# Altium project Digital Watch.PrjPcb
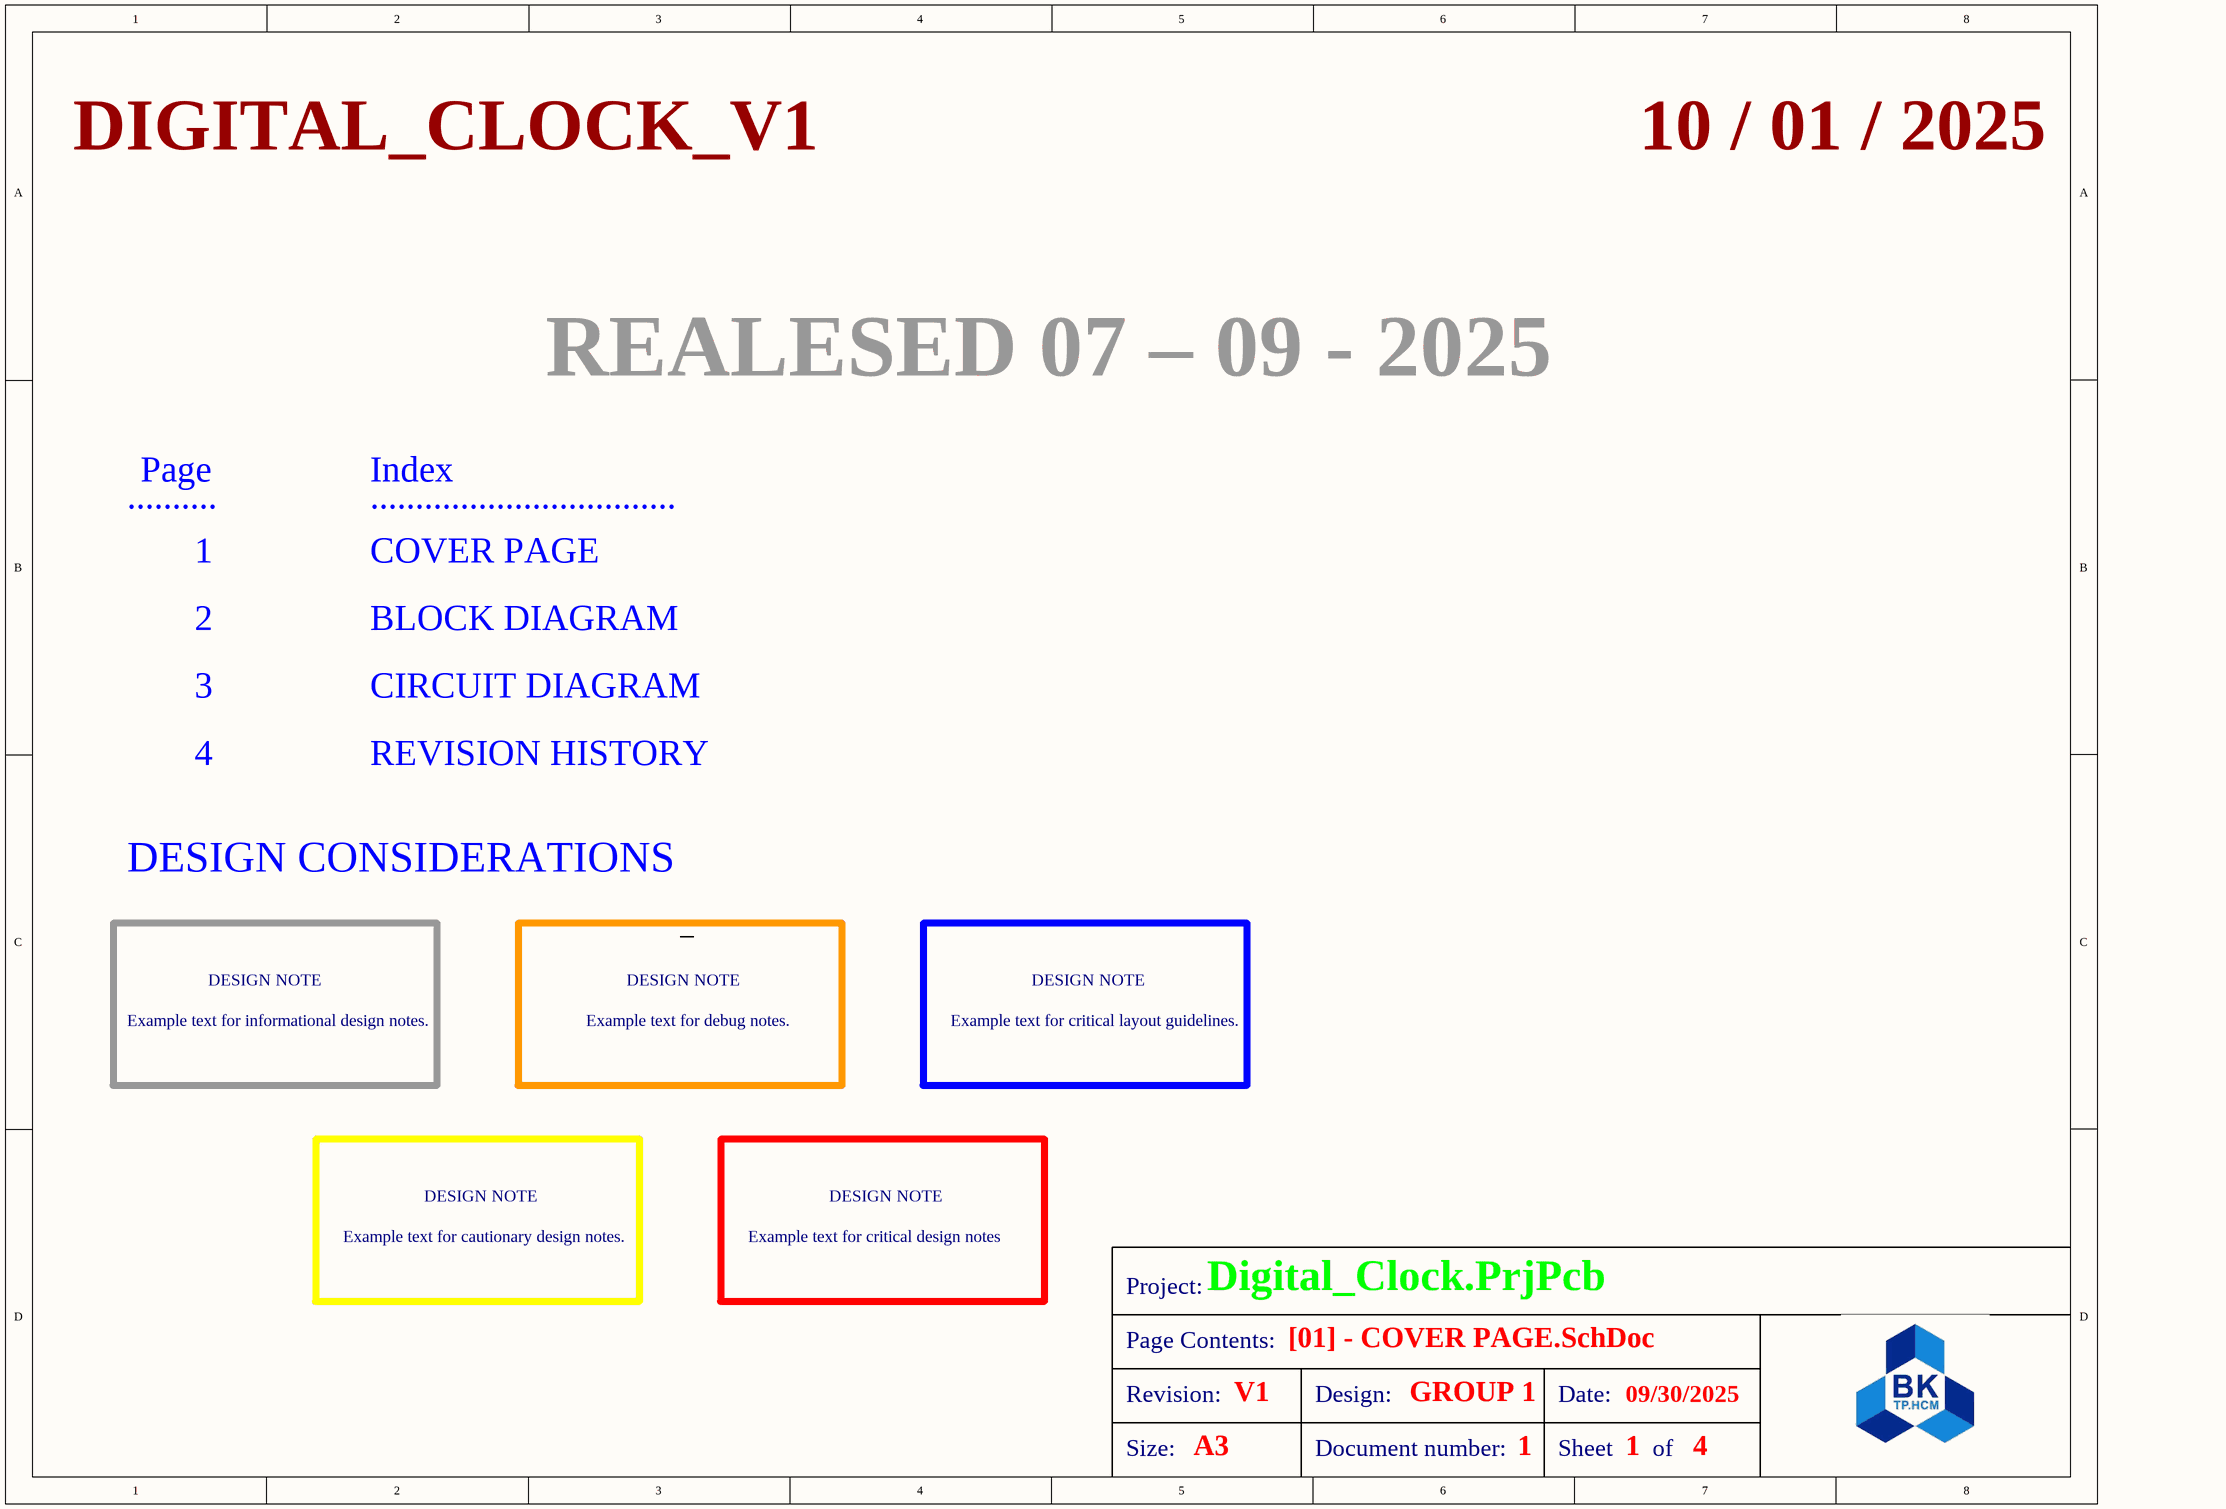
[diagram p0: BIA1.SchDoc]
5 sheets, 37 parts. Net scope: global (net labels, ports and power ports of the same name join across sheets).
Board file: PCB1.PcbDoc
Sheets:
  BIA1.SchDoc
  BLOCK DIAGRAM.SchDoc
  MCU.SchDoc
  LCD_BT.SchDoc
  Power_BZ_LED_HD.SchDoc

## Sheet BIA1.SchDoc
size A3

### Notes on the sheet
- DIGITAL_CLOCK_V1
- 10 / 01 / 2025
- REALESED 07 – 09 - 2025
- ..........
- Page
- Index
- ..................................
- 1
- COVER PAGE
- 2
- BLOCK DIAGRAM
- 3
- CIRCUIT DIAGRAM
- 4
- REVISION HISTORY
- DESIGN CONSIDERATIONS
- DESIGN NOTE
- Example text for informational design notes.
- Example text for debug notes.
- Example text for critical layout guidelines.
- Example text for cautionary design notes.
- Example text for critical design notes
- [01] - COVER PAGE.SchDoc
- A3
- V1
- GROUP 1
- 09/30/2025
- Project:
- Digital_Clock.PrjPcb
- Page Contents:
- Revision:
- Size:
- Design:
- Document number:
- Date:
- Sheet
- of

## Sheet BLOCK DIAGRAM.SchDoc
size A3; SheetNumber: 1; SheetTotal: 1
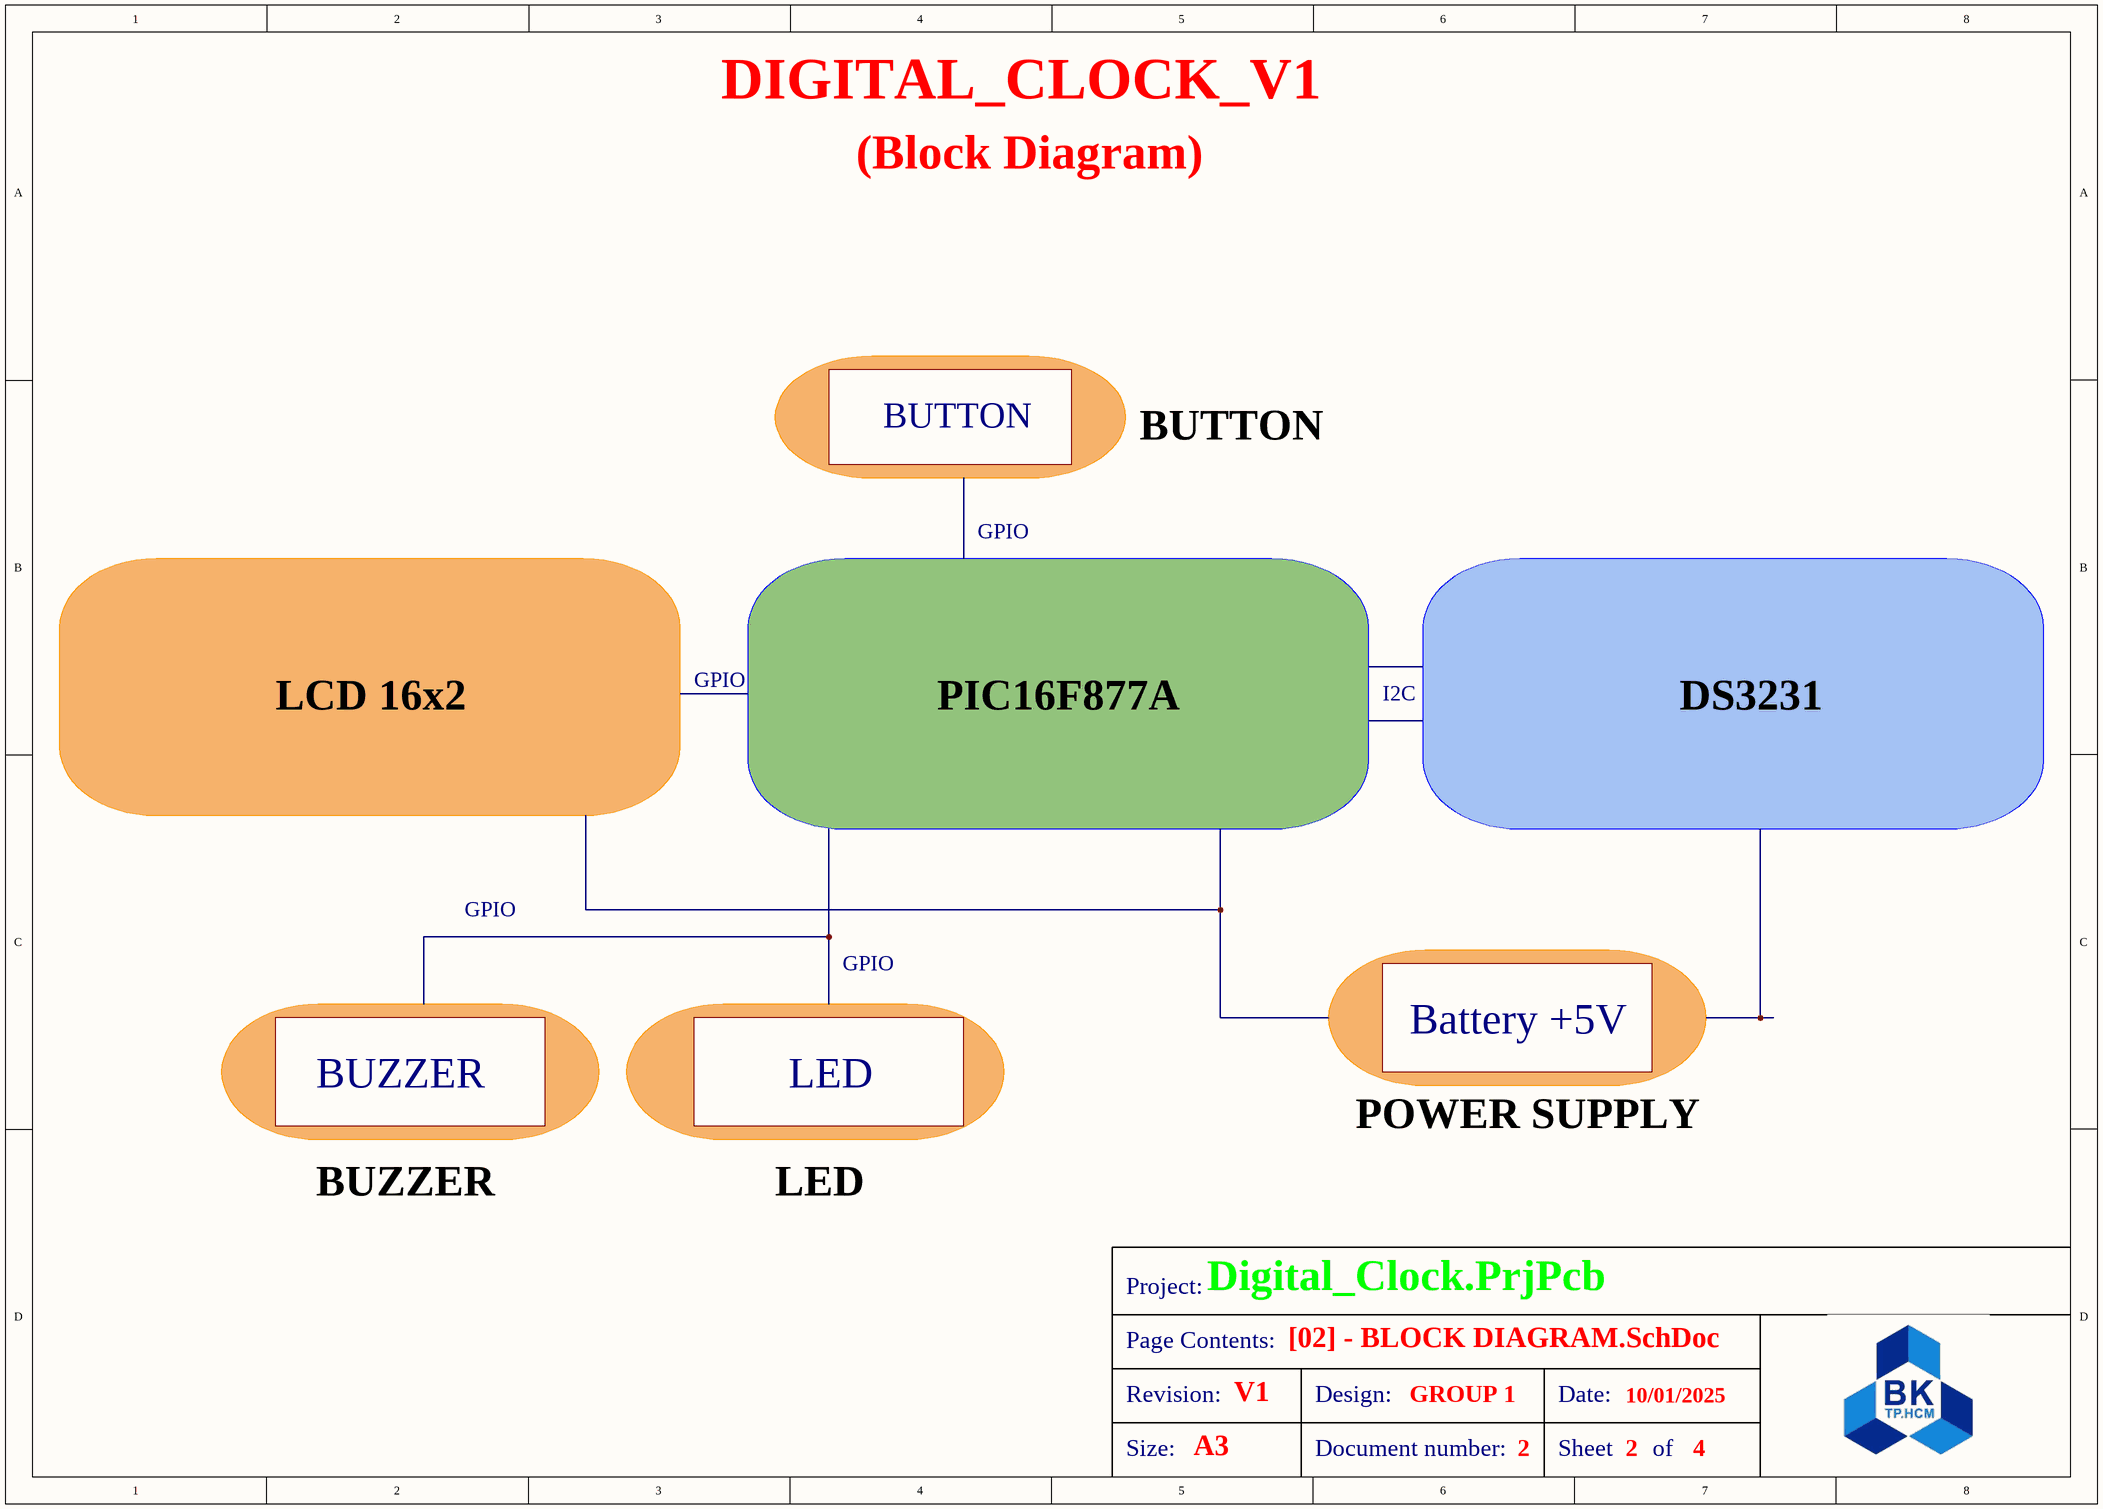
[diagram p1: BLOCK DIAGRAM.SchDoc]

### Notes on the sheet
- DIGITAL_CLOCK_V1
- (Block Diagram)
- BUTTON
- GPIO
- LCD 16x2
- PIC16F877A
- I2C
- DS3231
- Battery +5V
- BUZZER
- LED
- POWER SUPPLY
- [02] - BLOCK DIAGRAM.SchDoc
- A3
- V1
- GROUP 1
- 2
- 10/01/2025
- 4
- Project:
- Digital_Clock.PrjPcb
- Page Contents:
- Revision:
- Size:
- Design:
- Document number:
- Date:
- Sheet
- of

## Sheet MCU.SchDoc
size A3; SheetNumber: 3; SheetTotal: 6
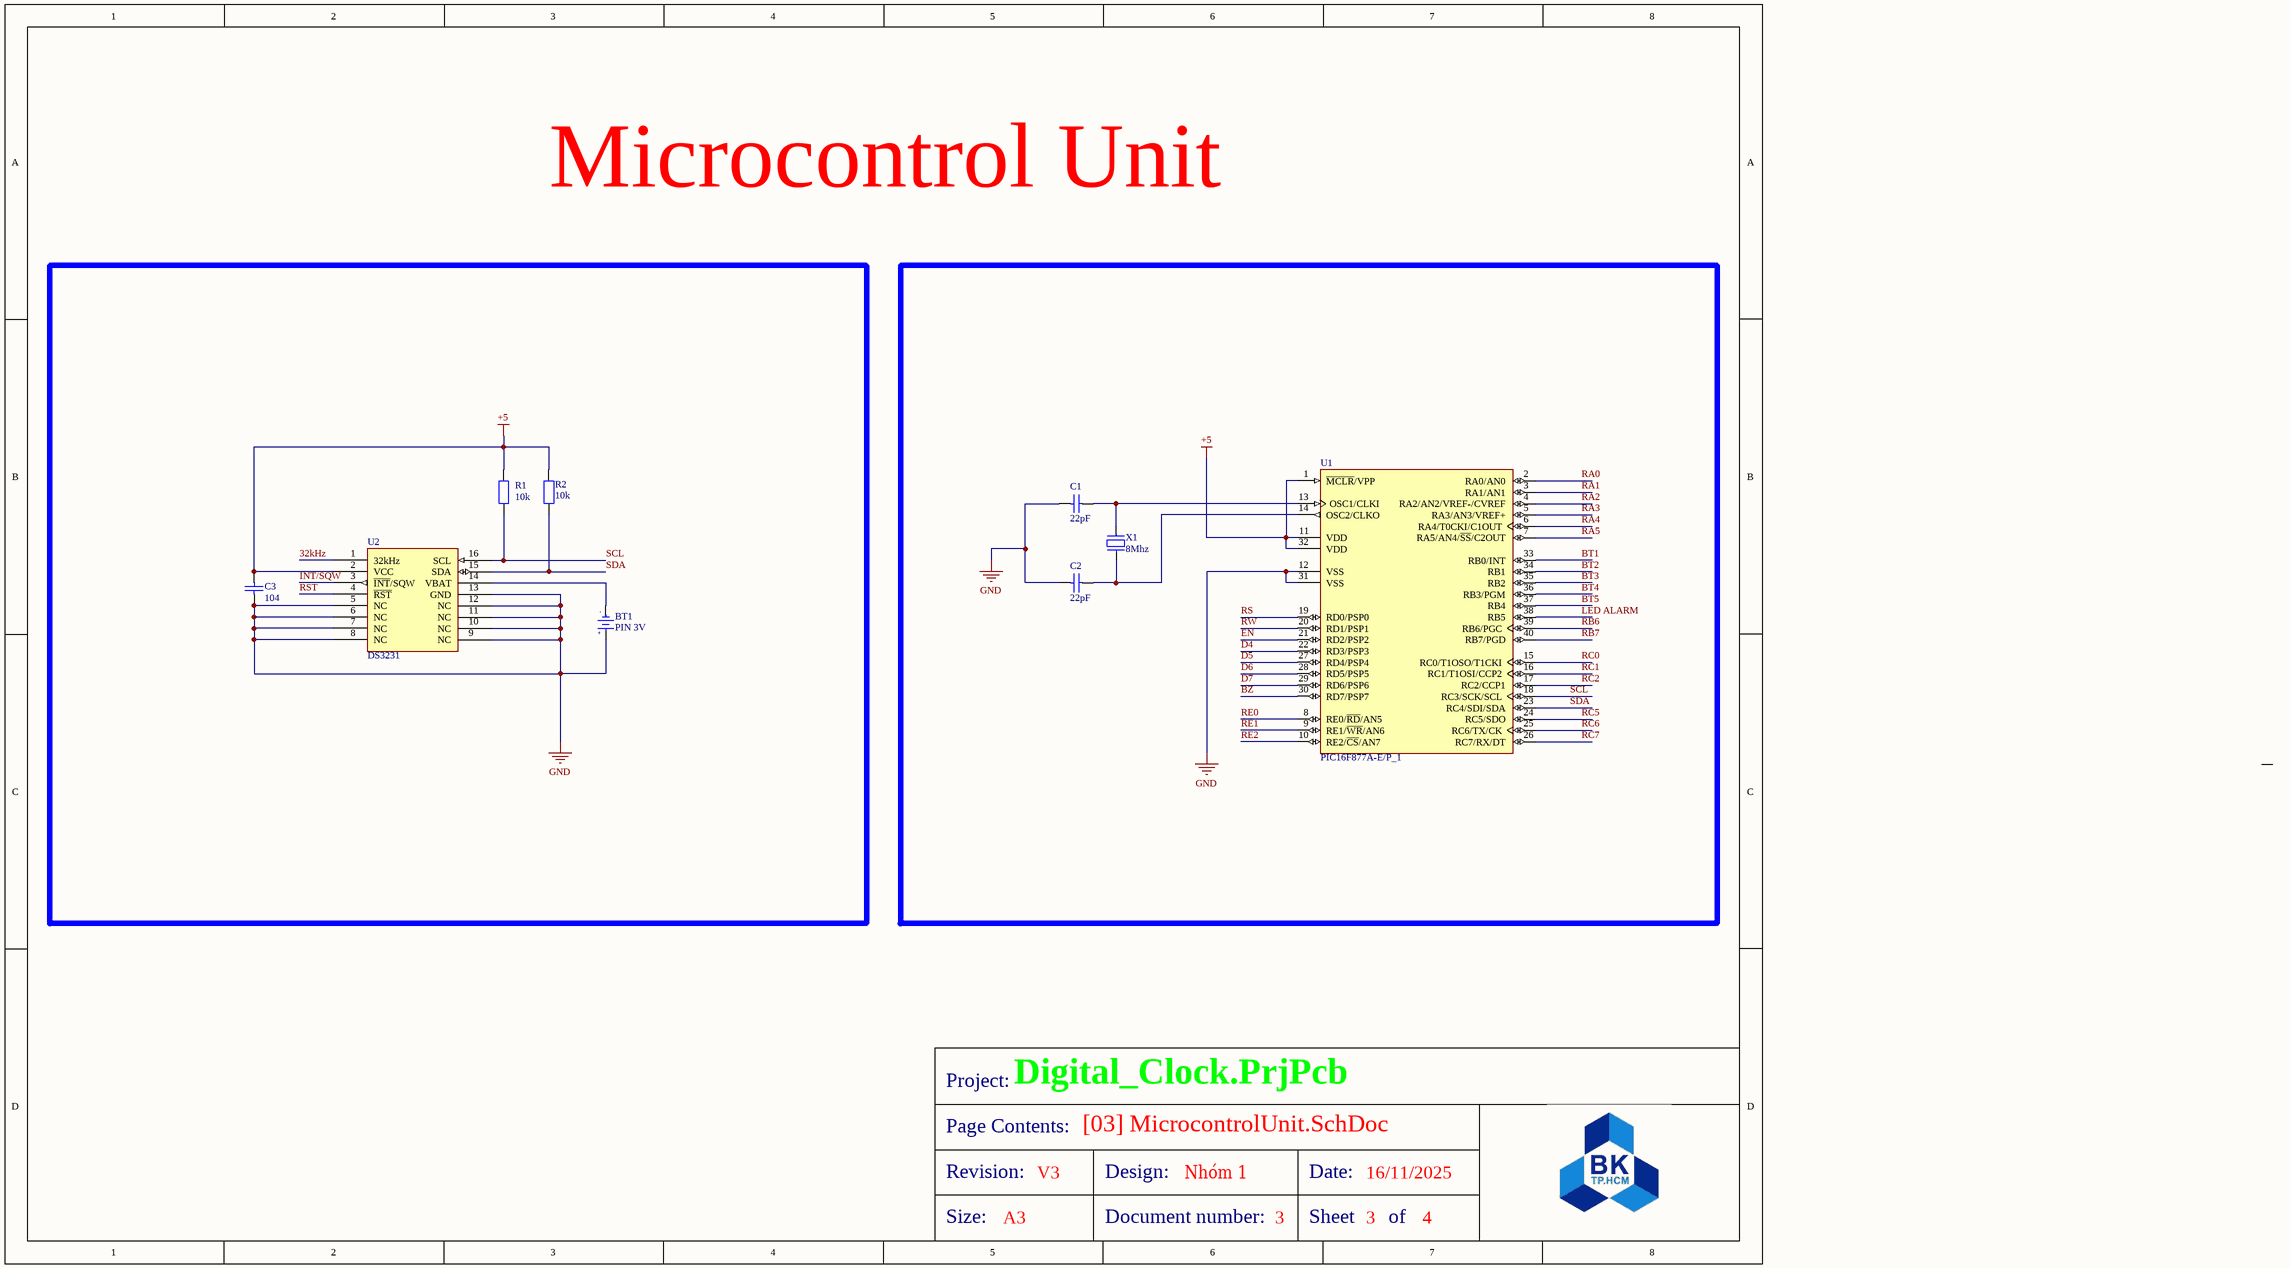
[diagram p2: MCU.SchDoc]

### Parts
BT1  PIN 3V  [PIN3V]
C1  22pF  [tu gom]
C2  22pF  [tu gom]
C3  104  [tu gom]
R1  10k  [tro smd 0603]
R2  10k  [tro smd 0603]
U1  PIC16F877A-E/P_1  [PDIP600-P40]
U2  DS3231  [SL3016]
X1  8Mhz  [XT2]

### Nets
+5: C3.1 R1.2 R2.2 U1.1(~{MCLR}/VPP) U1.11(VDD) U1.32(VDD) U2.2(VCC)
GND: BT1.1(+3V) C1.2 C2.2 C3.2 U1.12(VSS) U1.31(VSS) U2.5(NC) U2.6(NC) U2.7(NC) U2.8(NC) U2.9(NC) U2.10(NC) U2.11(NC) U2.12(NC) U2.13(GND)
32kHz: U2.1(32kHz)
BT1: U1.33(RB0/INT)
BT2: U1.34(RB1)
BT3: U1.35(RB2)
BT4: U1.36(RB3/PGM)
BT5: U1.37(RB4)
BZ: U1.30(RD7/PSP7)
D4: U1.22(RD3/PSP3)
D5: U1.27(RD4/PSP4)
D6: U1.28(RD5/PSP5)
D7: U1.29(RD6/PSP6)
EN: U1.21(RD2/PSP2)
INT/SQW: U2.3(~{INT}/SQW)
LED ALARM: U1.38(RB5)
RA0: U1.2(RA0/AN0)
RA1: U1.3(RA1/AN1)
RA2: U1.4(RA2/AN2/VREF-/CVREF)
RA3: U1.5(RA3/AN3/VREF+)
RA4: U1.6(RA4/T0CKI/C1OUT)
RA5: U1.7(RA5/AN4/~{SS}/C2OUT)
RB6: U1.39(RB6/PGC)
RB7: U1.40(RB7/PGD)
RC0: U1.15(RC0/T1OSO/T1CKI)
RC1: U1.16(RC1/T1OSI/CCP2)
RC2: U1.17(RC2/CCP1)
RC5: U1.24(RC5/SDO)
RC6: U1.25(RC6/TX/CK)
RC7: U1.26(RC7/RX/DT)
RE0: U1.8(RE0/~{RD}/AN5)
RE1: U1.9(RE1/~{WR}/AN6)
RE2: U1.10(RE2/~{CS}/AN7)
RS: U1.19(RD0/PSP0)
RST: U2.4(~{RST})
RW: U1.20(RD1/PSP1)
SCL: R1.1 U1.18(RC3/SCK/SCL) U2.16(SCL)
SDA: R2.1 U1.23(RC4/SDI/SDA) U2.15(SDA)
NetBT1_2: BT1.2(GND) U2.14(VBAT)
NetC1_1: C1.1 U1.13(OSC1/CLKI) X1.1
NetC2_1: C2.1 U1.14(OSC2/CLKO) X1.2

### Notes on the sheet
- Microcontrol Unit
- Project:
- Digital_Clock.PrjPcb
- Page Contents:
- [03] MicrocontrolUnit.SchDoc
- Revision:
- Size:
- A3
- V3
- Design:
- Document number:
- Nhóm 1
- 3
- Date:
- Sheet
- 16/11/2025
- of
- 4
- (in symbol PIN 3V) -; +

### Library data of the parts
BT1 = PIN 3V: Battery 3VDC; Value: PIN 3V
C1 C2 = Tu gom 22pF 50V: Cắm; Don_Vi: Con; So_Chan: 2; Ten_Linh_Kien: Tụ gốm 22P 50V; Ma_Hang: MH004771; Chung_Loai: Cắm; Kieu_Chan: *
C3 = Tu gom 104 50V: Cắm; So_Chan: 2; Ten_Linh_Kien: Tụ gốm 104 100nF 50V; Don_Vi: Con; Ma_Hang: MH004761; Chung_Loai: Cắm; Kieu_Chan: *
R1 R2 = Tro Vach 1/4W 5% 10k: Căm; Chung_Loai: Cắm; Don_Vi: Con; So_Chan: 2; Ten_Linh_Kien: Trở Vạch 1/4w 5% 10K; Ma_Hang: MH007354; Kieu_Chan: *
U1 = PIC16F877A-E/P_1: Enhanced FLASH Microcontroller, 8K (x14-Bit words) FLASH, 368 Bytes RAM, 40-Pin PDIP, Standard VDD Range, Extended Temperature; ComponentAvailability: Unknown. Contact manufacturer to determine status.; Published: 11-Oct-2004; LatestRevisionDate: 29-Jan-2009; LatestRevisionNote: Sch. layout revised. 3D Model Removed.; DatasheetVersion: revB, Oct-2003; PackageVersion: revBB, Aug-2009; PackageReference: PDIP600-P40; Publisher: Altium Limited; PackageDescription: 40-Lead Plastic Dual In-Line (P) - 600 mil Body [PDIP]; Supplier 1: Digi-Key; Supplier Part Number 1: PIC16F877A-E/P-ND; Supplier 2: Farnell; Supplier Part Number 2: 1567990; ComponentLink1Description: Datasheet; ComponentLink1URL: http://ww1.microchip.com/downloads/en/DeviceDoc/39582b.pdf; ComponentLink2Description: Packaging Specification; ComponentLink2URL: http://www.microchip.com/stellent/groups/techpub_sg/documents/packagingspec/en012702.pdf; ComponentLink3Description: Microchip.com Home; ComponentLink3URL: http://www.microchip.com/
X1 = XT2: Crystal For all Crystal 2pin.; Value: 8Mhz

## Sheet LCD_BT.SchDoc
size A3; SheetNumber: 4; SheetTotal: 6
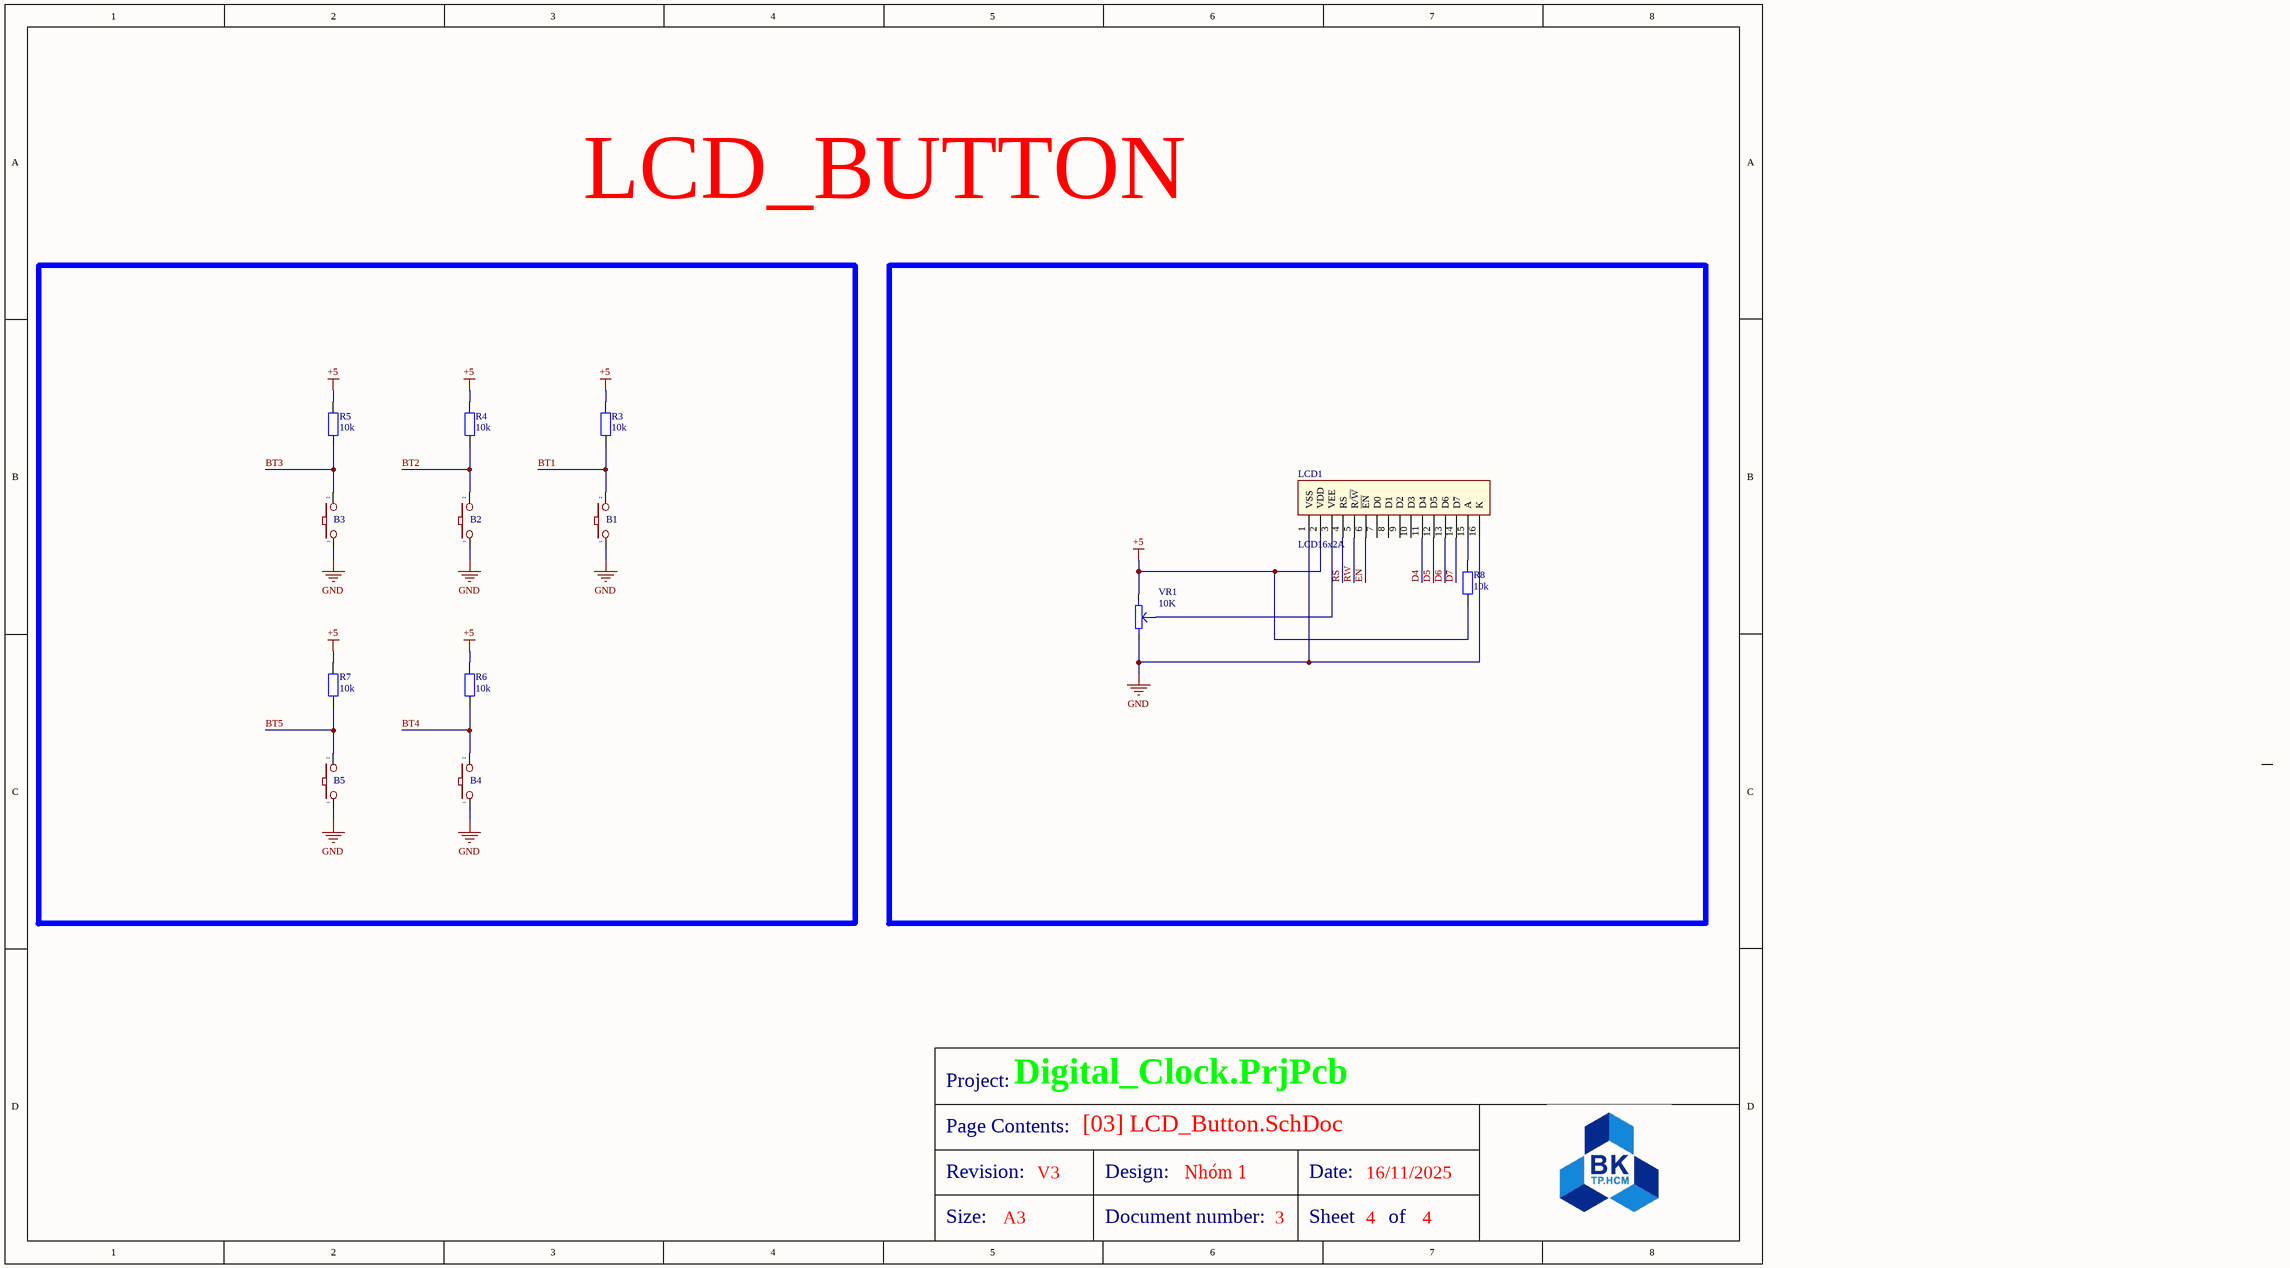
[diagram p3: LCD_BT.SchDoc]

### Parts
B1  (no value)  [SW2]
B2  (no value)  [SW2]
B3  (no value)  [SW2]
B4  (no value)  [SW2]
B5  (no value)  [SW2]
LCD1  LCD16x2A  [LCD16X2]
R3  10k  [tro smd 0603]
R4  10k  [tro smd 0603]
R5  10k  [tro smd 0603]
R6  10k  [tro smd 0603]
R7  10k  [tro smd 0603]
R8  10k  [tro smd 0603]
VR1  10K  [Bien Tro Tam Giac Dung]

### Nets
+5: LCD1.2(VDD) R3.1 R4.1 R5.1 R6.1 R7.1 R8.1 VR1.1
GND: B1.1 B2.1 B3.1 B4.1 B5.1 LCD1.1(VSS) LCD1.16(K) VR1.3
BT1: B1.2 R3.2
BT2: B2.2 R4.2
BT3: B3.2 R5.2
BT4: B4.2 R6.2
BT5: B5.2 R7.2
D4: LCD1.11(D4)
D5: LCD1.12(D5)
D6: LCD1.13(D6)
D7: LCD1.14(D7)
EN: LCD1.6(~{EN})
RS: LCD1.4(RS)
RW: LCD1.5(R/~{W})
NetLCD1_3: LCD1.3(VEE) VR1.2
NetLCD1_15: LCD1.15(A) R8.2

Not connected (* = marked no-connect by the designer): LCD1 7(D0) 8(D1) 9(D2) 10(D3)

### Notes on the sheet
- LCD_BUTTON
- Project:
- Digital_Clock.PrjPcb
- Page Contents:
- [03] LCD_Button.SchDoc
- Revision:
- Size:
- A3
- V3
- Design:
- Document number:
- Nhóm 1
- 3
- Date:
- Sheet
- 16/11/2025
- 4
- of

### Library data of the parts
B1-B5 = SW2: Switch button 2 pin; Value: SW chip 2 pin
LCD1 = LCD16x2: LCD dipslay 16 char, 2 line; Value: LCD16x2A
R3-R8 = Tro Vach 1/4W 5% 10k: as R1 on sheet MCU; Kieu_Chan: *
VR1 = Bien tro tam giac 10K Dung: Cắm; Ma_Hang: MH000919; Don_Vi: Con; Ten_Linh_Kien: Biến Trở Tam Giác 103-10K RM065 (Chân Đứng); Chung_Loai: Cắm; Kieu_Chan: *

## Sheet Power_BZ_LED_HD.SchDoc
size A3; SheetNumber: 5; SheetTotal: 6
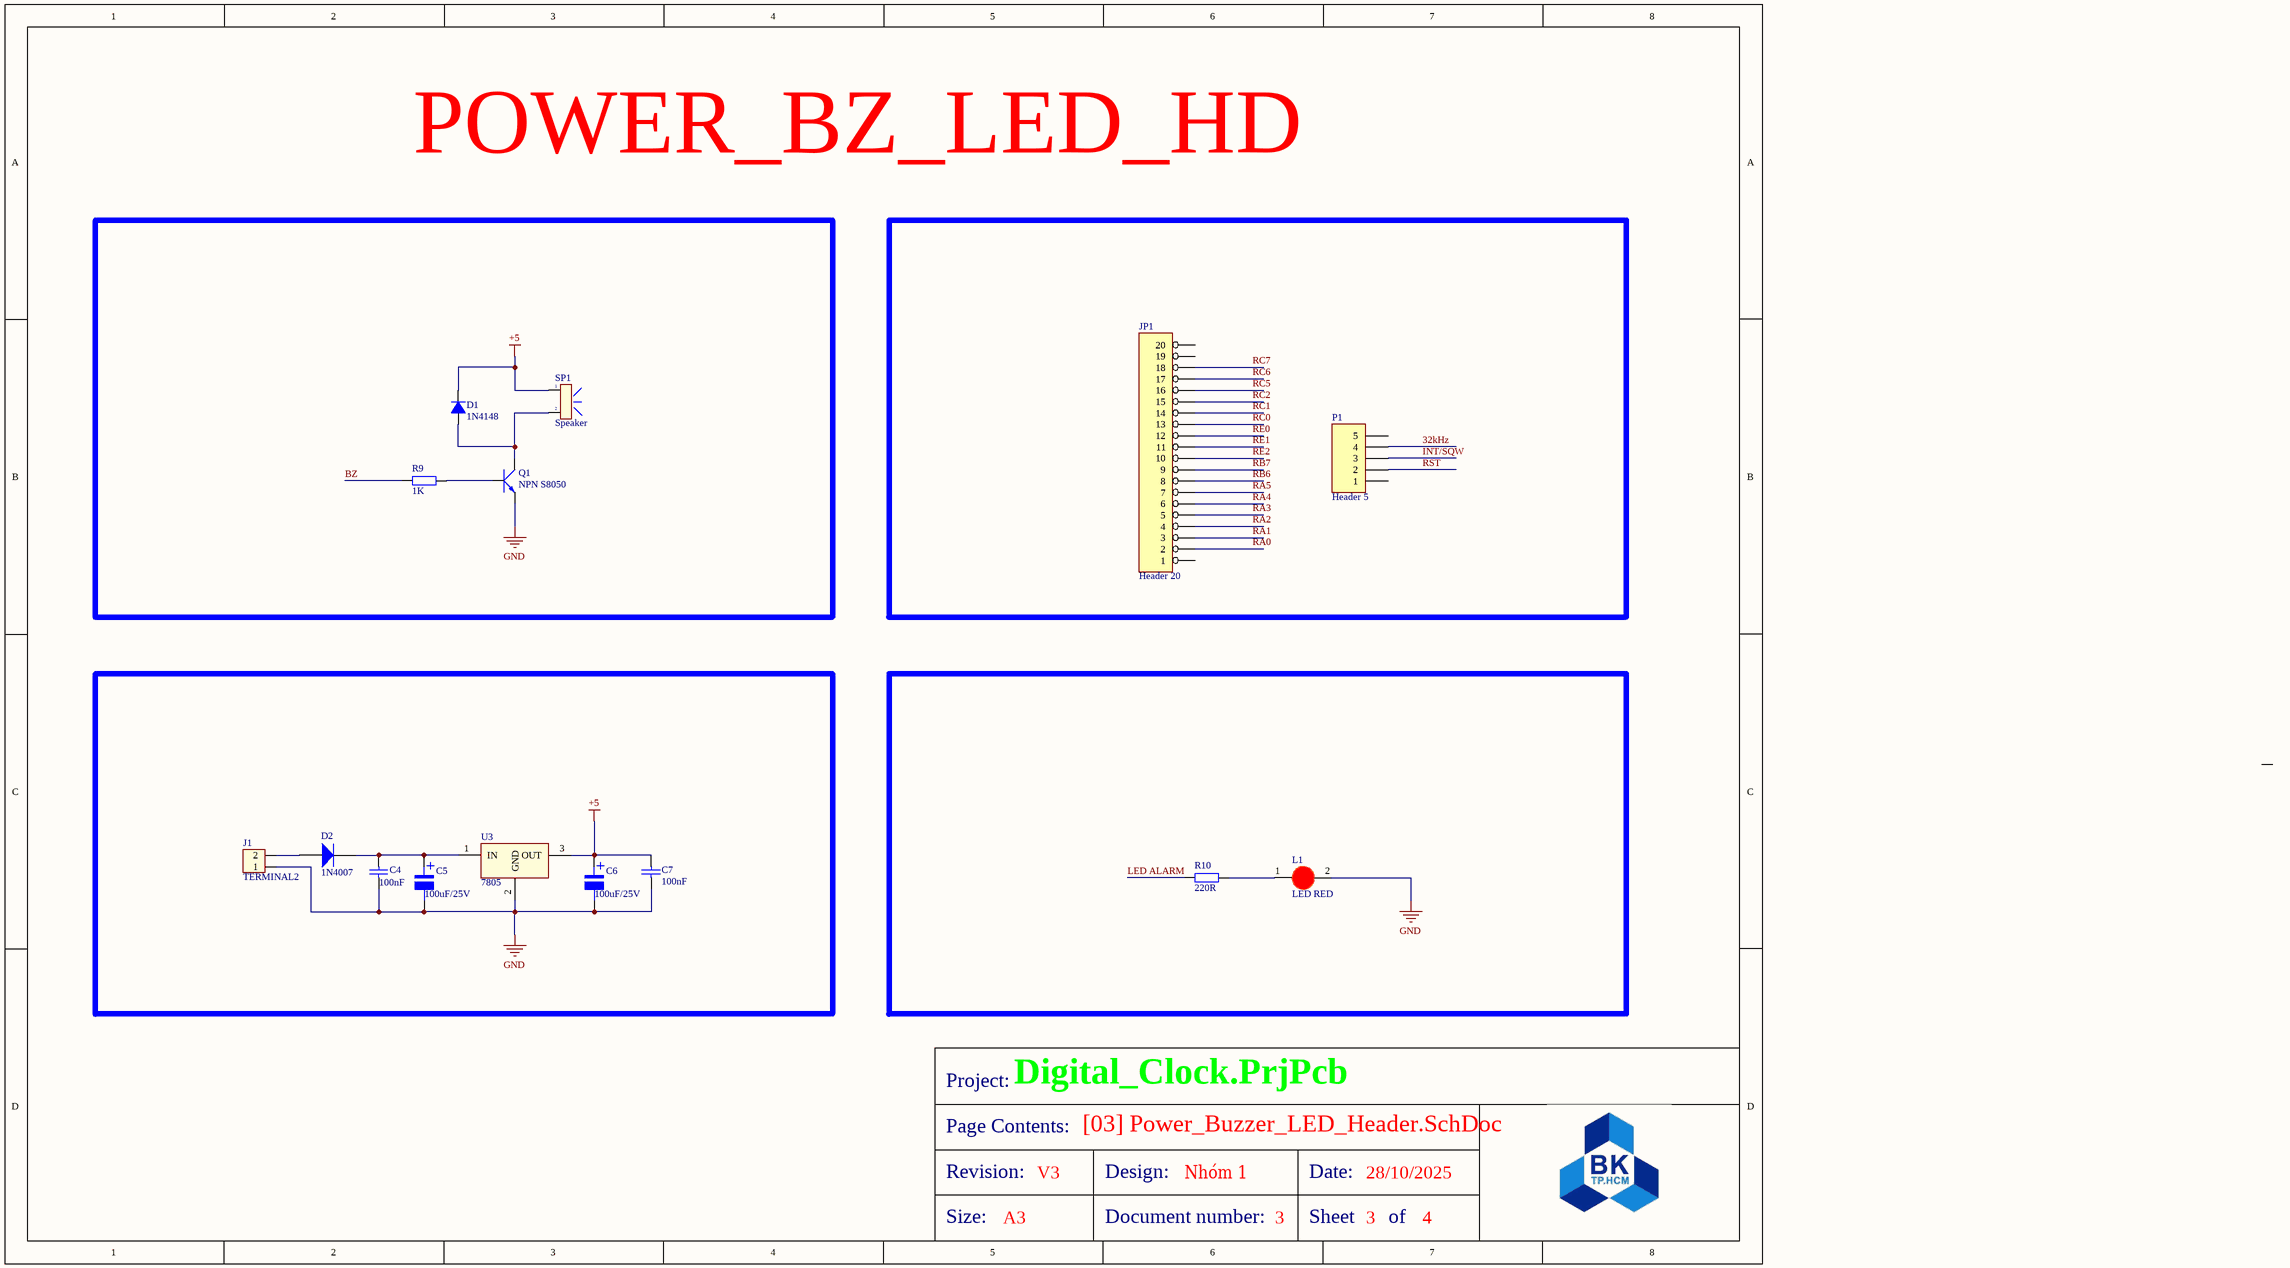
[diagram p4: Power_BZ_LED_HD.SchDoc]

### Parts
C4  100nF  [tu gom]
C5  100uF/25V  [tu nhom 10 (g)]
C6  100uF/25V  [tu nhom 10 (g)]
C7  100nF  [tu gom]
D1  1N4148  [DIODE 0.5A]
D2  1N4007  [DIODE SOD-123]
J1  TERMINAL2  [Header 2P DC 2.54]
JP1  Header 20
L1  LED RED  [LED-5MM-RED]
P1  Header 5
Q1  NPN S8050  [QTO-92]
R9  1K  [tro smd 0603]
R10  220R  [tro vach 1/4w]
SP1  Speaker  [SPK]
U3  7805  [QTO-220]

### Nets
+5: C6.1 C7.1 D1.2(K) SP1.1 U3.3(OUT)
GND: C4.2 C5.2 C6.2 C7.2 J1.1 L1.2(K) Q1.1(E) U3.2(GND)
32kHz: P1.4
BZ: R9.1
INT/SQW: P1.3
LED ALARM: R10.1
RA0: JP1.2
RA1: JP1.3
RA2: JP1.4
RA3: JP1.5
RA4: JP1.6
RA5: JP1.7
RB6: JP1.8
RB7: JP1.9
RC0: JP1.13
RC1: JP1.14
RC2: JP1.15
RC5: JP1.16
RC6: JP1.17
RC7: JP1.18
RE0: JP1.12
RE1: JP1.11
RE2: JP1.10
RST: P1.2
NetC4_1: C4.1 C5.1 D2.2(K) U3.1(IN)
NetD1_1: D1.1(A) Q1.2(C) SP1.2
NetD2_1: D2.1(A) J1.2
NetL1_1: L1.1(A) R10.2
NetQ1_3: Q1.3(B) R9.2

Not connected (* = marked no-connect by the designer): JP1 1 19 20; P1 1 5

### Notes on the sheet
- POWER_BZ_LED_HD
- Project:
- Digital_Clock.PrjPcb
- Page Contents:
- [03] Power_Buzzer_LED_Header.SchDoc
- Revision:
- Size:
- A3
- V3
- Design:
- Document number:
- Nhóm 1
- 3
- Date:
- Sheet
- 28/10/2025
- of
- 4
- (in symbol Tu Nhom 100uF 35V) +

### Library data of the parts
C4 C7 = Tu gom 22pF 50V: as C1 on sheet MCU; Chung_Loai: Cắm; Kieu_Chan: *
C5 C6 = Tu Nhom 100uF 35V: Dán; Don_Vi: Con; Ten_Linh_Kien: Tụ Nhôm 100uF 35V; Ma_Hang: MH004019; So_Chan: 2; Chung_Loai: Dán; Kieu_Chan: *
D1 = Diode 1N4148: Cắm; Ten_Linh_Kien: Diode 1N4148 DO35 450mA 100V ( 1N4148 DIP); Don_Vi: Con; Ma_Hang: MH001065; Ghi Chu: *; Kieu_Chan: *; Chung_Loai: Cắm
D2 = Diode S4: Dán; Ten_Linh_Kien: Diode S4 SOD123 ( 1N5819 SOD123); Ma_Hang: MH005519; Don_Vi: Con; Ghi_Chu: *; Chung_Loai: Dán; Kieu_Chan: *
J1 = Header 2P 2.54 Duc Cong: Cắm; Ten_Linh_Kien: Header 2P XH2.54-2P Đực Cong; Don_Vi: Con; Ma_Hang: MH002852; Chung_Loai: Cắm
JP1 = Header 20: Header, 20-Pin, Right Angle
L1 = LED 5mm Do: Cắm; Don_Vi: Con; Ma_Hang: MH008967; Ten_Linh_Kien: Led 5MM Phủ Đỏ (1000c); Ghi_Chu: *; Kieu_Chan: *; Chung_Loai: Cắm
P1 = Header 5: Header, 5-Pin; LatestRevisionDate: 17-Jul-2002; LatestRevisionNote: Re-released for DXP Platform.; Publisher: Altium Limited
Q1 = NPN_ECB: P 600mW, ECB; Value: C1815
R9 = Tro Vach 1/4W 5% 4.7k: Cắm; Don_Vi: Con; So_Chan: 2; Ten_Linh_Kien: Trở Vạch 1/4w 5% 4.7k; Ma_Hang: MH007317; Chung_Loai: Cắm; Kieu_Chan: *
R10 = Tro Vach 1/4W 5% 220R: Cắm; Don_Vi: Con; So_Chan: 2; Ten_Linh_Kien: Trở Vạch 1/4w 5% 220R; Ma_Hang: MH007300; Chung_Loai: Cắm; Kieu_Chan: *
SP1 = SPK: Speaker Chip; Value: Speaker Chip
U3 = LM78xx: On ap +, from + 5 to + 24VDC; Value: LM7805

## Nets that join several sheets
+5: MCU (7 pins), LCD_BT (8 pins), Power_BZ_LED_HD (5 pins)
GND: MCU (15 pins), LCD_BT (8 pins), Power_BZ_LED_HD (8 pins)
32kHz: MCU (U2.1), Power_BZ_LED_HD (P1.4)
BT1: MCU (U1.33), LCD_BT (B1.2 R3.2)
BT2: MCU (U1.34), LCD_BT (B2.2 R4.2)
BT3: MCU (U1.35), LCD_BT (B3.2 R5.2)
BT4: MCU (U1.36), LCD_BT (B4.2 R6.2)
BT5: MCU (U1.37), LCD_BT (B5.2 R7.2)
BZ: MCU (U1.30), Power_BZ_LED_HD (R9.1)
D4: MCU (U1.22), LCD_BT (LCD1.11)
D5: MCU (U1.27), LCD_BT (LCD1.12)
D6: MCU (U1.28), LCD_BT (LCD1.13)
D7: MCU (U1.29), LCD_BT (LCD1.14)
EN: MCU (U1.21), LCD_BT (LCD1.6)
INT/SQW: MCU (U2.3), Power_BZ_LED_HD (P1.3)
LED ALARM: MCU (U1.38), Power_BZ_LED_HD (R10.1)
RA0: MCU (U1.2), Power_BZ_LED_HD (JP1.2)
RA1: MCU (U1.3), Power_BZ_LED_HD (JP1.3)
RA2: MCU (U1.4), Power_BZ_LED_HD (JP1.4)
RA3: MCU (U1.5), Power_BZ_LED_HD (JP1.5)
RA4: MCU (U1.6), Power_BZ_LED_HD (JP1.6)
RA5: MCU (U1.7), Power_BZ_LED_HD (JP1.7)
RB6: MCU (U1.39), Power_BZ_LED_HD (JP1.8)
RB7: MCU (U1.40), Power_BZ_LED_HD (JP1.9)
RC0: MCU (U1.15), Power_BZ_LED_HD (JP1.13)
RC1: MCU (U1.16), Power_BZ_LED_HD (JP1.14)
RC2: MCU (U1.17), Power_BZ_LED_HD (JP1.15)
RC5: MCU (U1.24), Power_BZ_LED_HD (JP1.16)
RC6: MCU (U1.25), Power_BZ_LED_HD (JP1.17)
RC7: MCU (U1.26), Power_BZ_LED_HD (JP1.18)
RE0: MCU (U1.8), Power_BZ_LED_HD (JP1.12)
RE1: MCU (U1.9), Power_BZ_LED_HD (JP1.11)
RE2: MCU (U1.10), Power_BZ_LED_HD (JP1.10)
RS: MCU (U1.19), LCD_BT (LCD1.4)
RST: MCU (U2.4), Power_BZ_LED_HD (P1.2)
RW: MCU (U1.20), LCD_BT (LCD1.5)